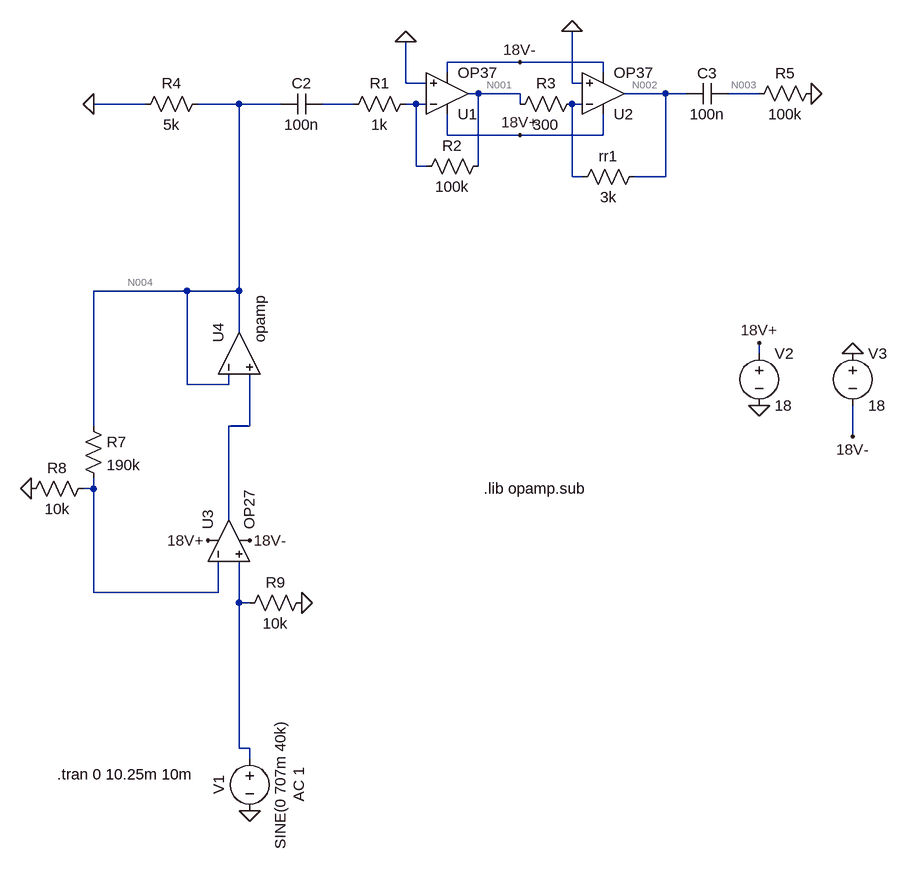
[diagram p0: schematic powerAmp.asc]
powerAmp.asc, the LTspice schematic file:
Version 4
SHEET 1 904 920
WIRE 336 -304 224 -304
WIRE 464 -304 336 -304
WIRE 224 -288 224 -304
WIRE 464 -288 464 -304
WIRE 160 -272 160 -336
WIRE 192 -272 160 -272
WIRE 416 -272 416 -352
WIRE 432 -272 416 -272
WIRE 272 -256 256 -256
WIRE 336 -256 272 -256
WIRE 560 -256 496 -256
WIRE 592 -256 560 -256
WIRE 704 -256 656 -256
WIRE -240 -240 -320 -240
WIRE -96 -240 -160 -240
WIRE -32 -240 -96 -240
WIRE 80 -240 32 -240
WIRE 176 -240 160 -240
WIRE 192 -240 176 -240
WIRE 336 -240 336 -256
WIRE 432 -240 416 -240
WIRE 224 -192 224 -224
WIRE 336 -192 224 -192
WIRE 464 -192 464 -224
WIRE 464 -192 336 -192
WIRE 176 -144 176 -240
WIRE 192 -144 176 -144
WIRE 272 -144 272 -256
WIRE 416 -128 416 -240
WIRE 432 -128 416 -128
WIRE 560 -128 560 -256
WIRE 560 -128 512 -128
WIRE -176 48 -320 48
WIRE -96 48 -96 -240
WIRE -96 48 -176 48
WIRE -96 112 -96 48
WIRE 704 144 704 128
WIRE -176 192 -176 48
WIRE -112 192 -112 176
WIRE -112 192 -176 192
WIRE -320 256 -320 48
WIRE -80 256 -80 176
WIRE -80 256 -112 256
WIRE 848 272 848 224
WIRE -320 352 -320 336
WIRE -320 352 -336 352
WIRE -112 400 -112 256
WIRE -320 512 -320 352
WIRE -128 512 -128 464
WIRE -128 512 -320 512
WIRE -96 528 -96 464
WIRE -80 528 -96 528
WIRE -96 752 -96 528
WIRE -80 752 -96 752
WIRE -80 768 -80 752
FLAG 704 224 0
FLAG 848 144 0
FLAG 704 128 18V+
FLAG 336 -304 18V-
FLAG 336 -192 18V+
FLAG 848 272 18V-
FLAG -80 848 0
FLAG 416 -352 0
FLAG 160 -336 0
FLAG 784 -256 0
FLAG -144 432 18V+
FLAG -80 432 18V-
FLAG 0 528 0
FLAG -416 352 0
FLAG -320 -240 0
DATAFLAG -96 -16 ""
SYMBOL OpAmps\\OP37 224 -192 M180
SYMATTR InstName U1
SYMBOL OpAmps\\OP37 464 -192 M180
SYMATTR InstName U2
SYMBOL voltage -80 752 R0
WINDOW 0 -32 56 VBottom 2
WINDOW 3 32 56 VTop 2
WINDOW 123 60 56 VTop 2
WINDOW 39 0 0 Left 0
SYMATTR InstName V1
SYMATTR Value SINE(0 707m 40k)
SYMATTR Value2 AC 1
SYMBOL voltage 704 128 R0
WINDOW 123 0 0 Left 0
WINDOW 39 0 0 Left 0
SYMATTR InstName V2
SYMATTR Value 18
SYMBOL voltage 848 128 R0
WINDOW 123 0 0 Left 0
WINDOW 39 0 0 Left 0
SYMATTR InstName V3
SYMATTR Value 18
SYMBOL res 176 -256 R90
WINDOW 0 0 56 VBottom 2
WINDOW 3 32 56 VTop 2
SYMATTR InstName R1
SYMATTR Value 1k
SYMBOL res 288 -160 R90
WINDOW 0 0 56 VBottom 2
WINDOW 3 32 56 VTop 2
SYMATTR InstName R2
SYMATTR Value 100k
SYMBOL res 432 -256 R90
WINDOW 0 0 56 VBottom 2
WINDOW 3 32 56 VTop 2
SYMATTR InstName R3
SYMATTR Value 300
SYMBOL res 528 -144 R90
WINDOW 0 0 56 VBottom 2
WINDOW 3 32 56 VTop 2
SYMATTR InstName rr1
SYMATTR Value 3k
SYMBOL res -144 -256 R90
WINDOW 0 0 56 VBottom 2
WINDOW 3 32 56 VTop 2
SYMATTR InstName R4
SYMATTR Value 5k
SYMBOL res 800 -272 R90
WINDOW 0 0 56 VBottom 2
WINDOW 3 32 56 VTop 2
SYMATTR InstName R5
SYMATTR Value 100k
SYMBOL OpAmps\\OP27 -176 432 R270
SYMATTR InstName U3
SYMBOL cap -32 -224 R270
WINDOW 0 32 32 VTop 2
WINDOW 3 0 32 VBottom 2
SYMATTR InstName C2
SYMATTR Value 100n
SYMBOL cap 592 -240 R270
WINDOW 0 32 32 VTop 2
WINDOW 3 0 32 VBottom 2
SYMATTR InstName C3
SYMATTR Value 100n
SYMBOL OpAmps\\opamp -160 144 R270
SYMATTR InstName U4
SYMBOL res -336 240 R0
SYMATTR InstName R7
SYMATTR Value 190k
SYMBOL res -320 336 R90
WINDOW 0 0 56 VBottom 2
WINDOW 3 32 56 VTop 2
SYMATTR InstName R8
SYMATTR Value 10k
SYMBOL res -96 544 R270
WINDOW 0 32 56 VTop 2
WINDOW 3 0 56 VBottom 2
SYMATTR InstName R9
SYMATTR Value 10k
TEXT -376 792 Left 2 !.tran 0 10.25m 10m
TEXT 280 352 Left 2 !.lib opamp.sub

The netlist it stands for:
* powerAmp.asc
XU1 0 N006 18V+ 18V- N001 LT1037  ; OP37, pins In+ In- V+ V- OUT
XU2 0 N007 18V+ 18V- N002 LT1037  ; OP37, pins In+ In- V+ V- OUT
V1 N010 0 SINE(0 707m 40k) AC 1
V2 18V+ 0 18
V3 0 18V- 18
R1 N006 N005 1k
R2 N001 N006 100k
R3 N007 N001 300
rr1 N002 N007 3k
R4 N004 0 5k
R5 0 N003 100k
XU3 N010 N009 18V+ 18V- N008 OP27  ; pins In+ In- V+ V- OUT
C2 N004 N005 100n
C3 N002 N003 100n
XU4 N004 N008 N004 opamp Aol=100K GBW=10Meg  ; pins invin noninvin out
R7 N004 N009 190k
R8 N009 0 10k
R9 N010 0 10k
.tran 0 10.25m 10m
.lib opamp.sub
.lib LTC.lib
.lib ADI.lib
.backanno
.end

* Results of the author's LTspice run, read from the files saved beside the schematic
* Operating Point, zero values left out:
*   V(18v+) = 18 V
*   V(18v-) = -18 V
*   I(V3) = -9.353 mA
*   I(V2) = -9.353 mA
*   Ix(u1:3) = 3.118 mA
*   Ix(u1:4) = -3.118 mA
*   Ix(u2:3) = 3.118 mA
*   Ix(u2:4) = -3.118 mA
*   Ix(u3:3) = 3.118 mA
*   Ix(u3:4) = -3.118 mA
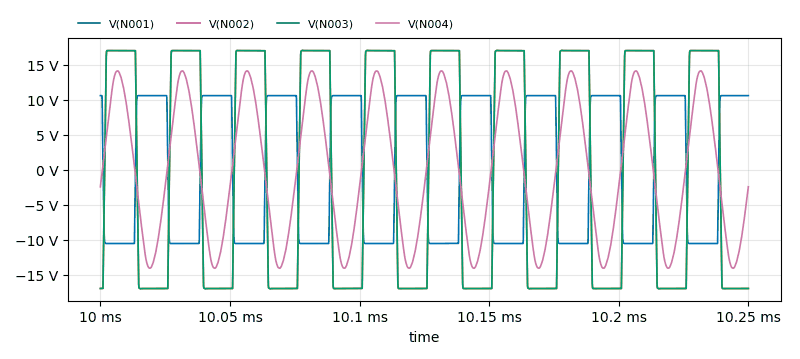
[diagram p1: Transient Analysis of powerAmp.asc, plotted from the saved traces]
* Transient Analysis, 1 run:
*   V(N001): min -10.57 V, max 10.57 V, average 543 µV, rms 10.31 V, last 10.56 V
*   V(N002): min -17.02 V, max 17.02 V, average -719.5 µV, rms 16.4 V, last -17 V
*   V(N003): min -17.04 V, max 17.03 V, average -3.73 mV, rms 16.4 V, last -16.99 V
*   V(N004): min -14.11 V, max 14.11 V, average 298.8 µV, rms 9.682 V, last -2.453 V